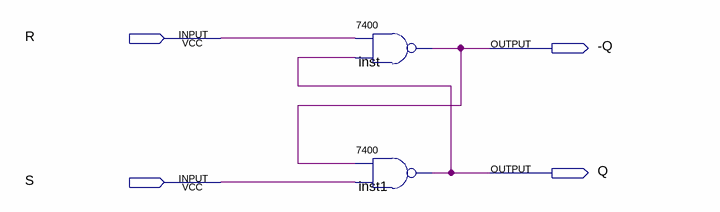
[diagram p0: schematic sheet]
// Quartus schematic RS.bdf as structural Verilog: 2 symbols, 4 pins
module RS (
  input  R,
  input  S,
  output \-Q ,
  output Q
);

  \7400  inst (.\3 (Q), .\2 (R), .\1 (\-Q ));
  \7400  inst1 (.\3 (S), .\2 (\-Q ), .\1 (Q));
endmodule
